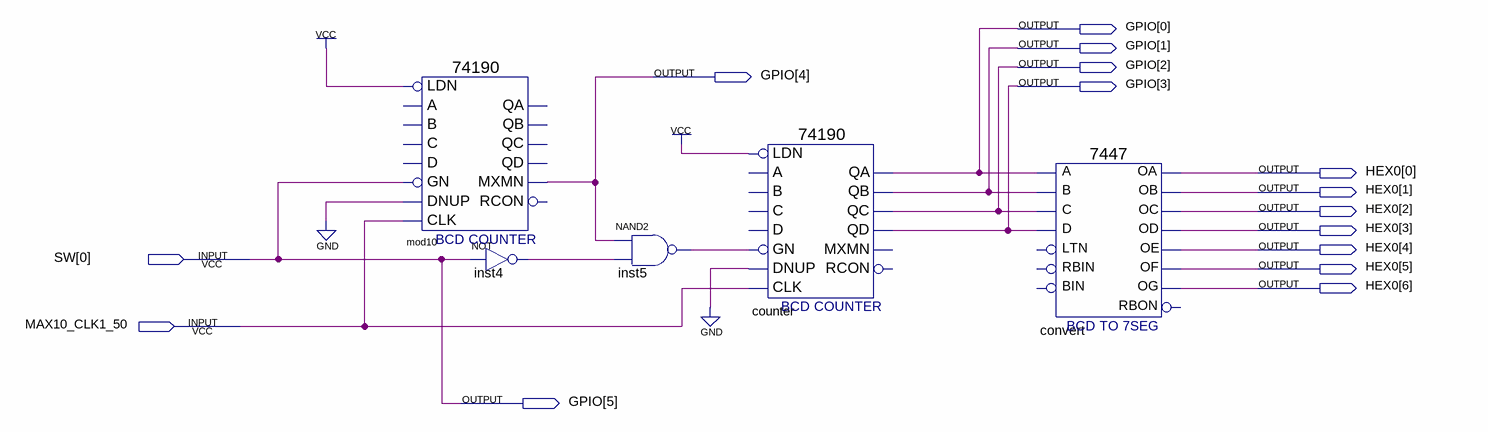
[diagram p0: schematic sheet]
// Quartus schematic 1.bdf as structural Verilog: 5 symbols, 15 pins
module \1  (
  input  [0:0] SW,
  input  MAX10_CLK1_50,
  output [5:0] GPIO,
  output [6:0] HEX0
);

  wire inst4_out, inst5_out;

  \74190  mod10 (
    .LDN(1'b1), .GN(SW[0]), .CLK(MAX10_CLK1_50), .DNUP(1'b0), .MXMN(GPIO[4]));  // open: A, C, B, D, QA, QB, QD, QC, RCON
  not inst4 (inst4_out, SW[0]);
  nand inst5 (inst5_out, GPIO[4], inst4_out);
  \74190  counter (
    .LDN(1'b1), .GN(inst5_out), .CLK(MAX10_CLK1_50), .DNUP(1'b0), .QA(GPIO[0]), .QB(GPIO[1]), .QD(GPIO[3]),
    .QC(GPIO[2]));  // open: A, C, B, D, MXMN, RCON
  \7447  convert (
    .B(GPIO[1]), .C(GPIO[2]), .D(GPIO[3]), .A(GPIO[0]), .OB(HEX0[1]), .OC(HEX0[2]), .OE(HEX0[4]),
    .OD(HEX0[3]), .OF(HEX0[5]), .OG(HEX0[6]), .OA(HEX0[0]));  // open: LTN, RBIN, BIN, RBON

  assign GPIO[5] = SW[0];
endmodule
